# Altium schematic sheet AirPurity.SchDoc: [FILL-HERE]
size A3; ApprovedBy: [FILL-HERE]; Author: [FILL-HERE]; Organization: [FILL-HERE]; Address1: [FILL-HERE]; Address2: [FILL-HERE]; Address3: [FILL-HERE]; Address4: [FILL-HERE]; SheetNumber: 1; SheetTotal: 1
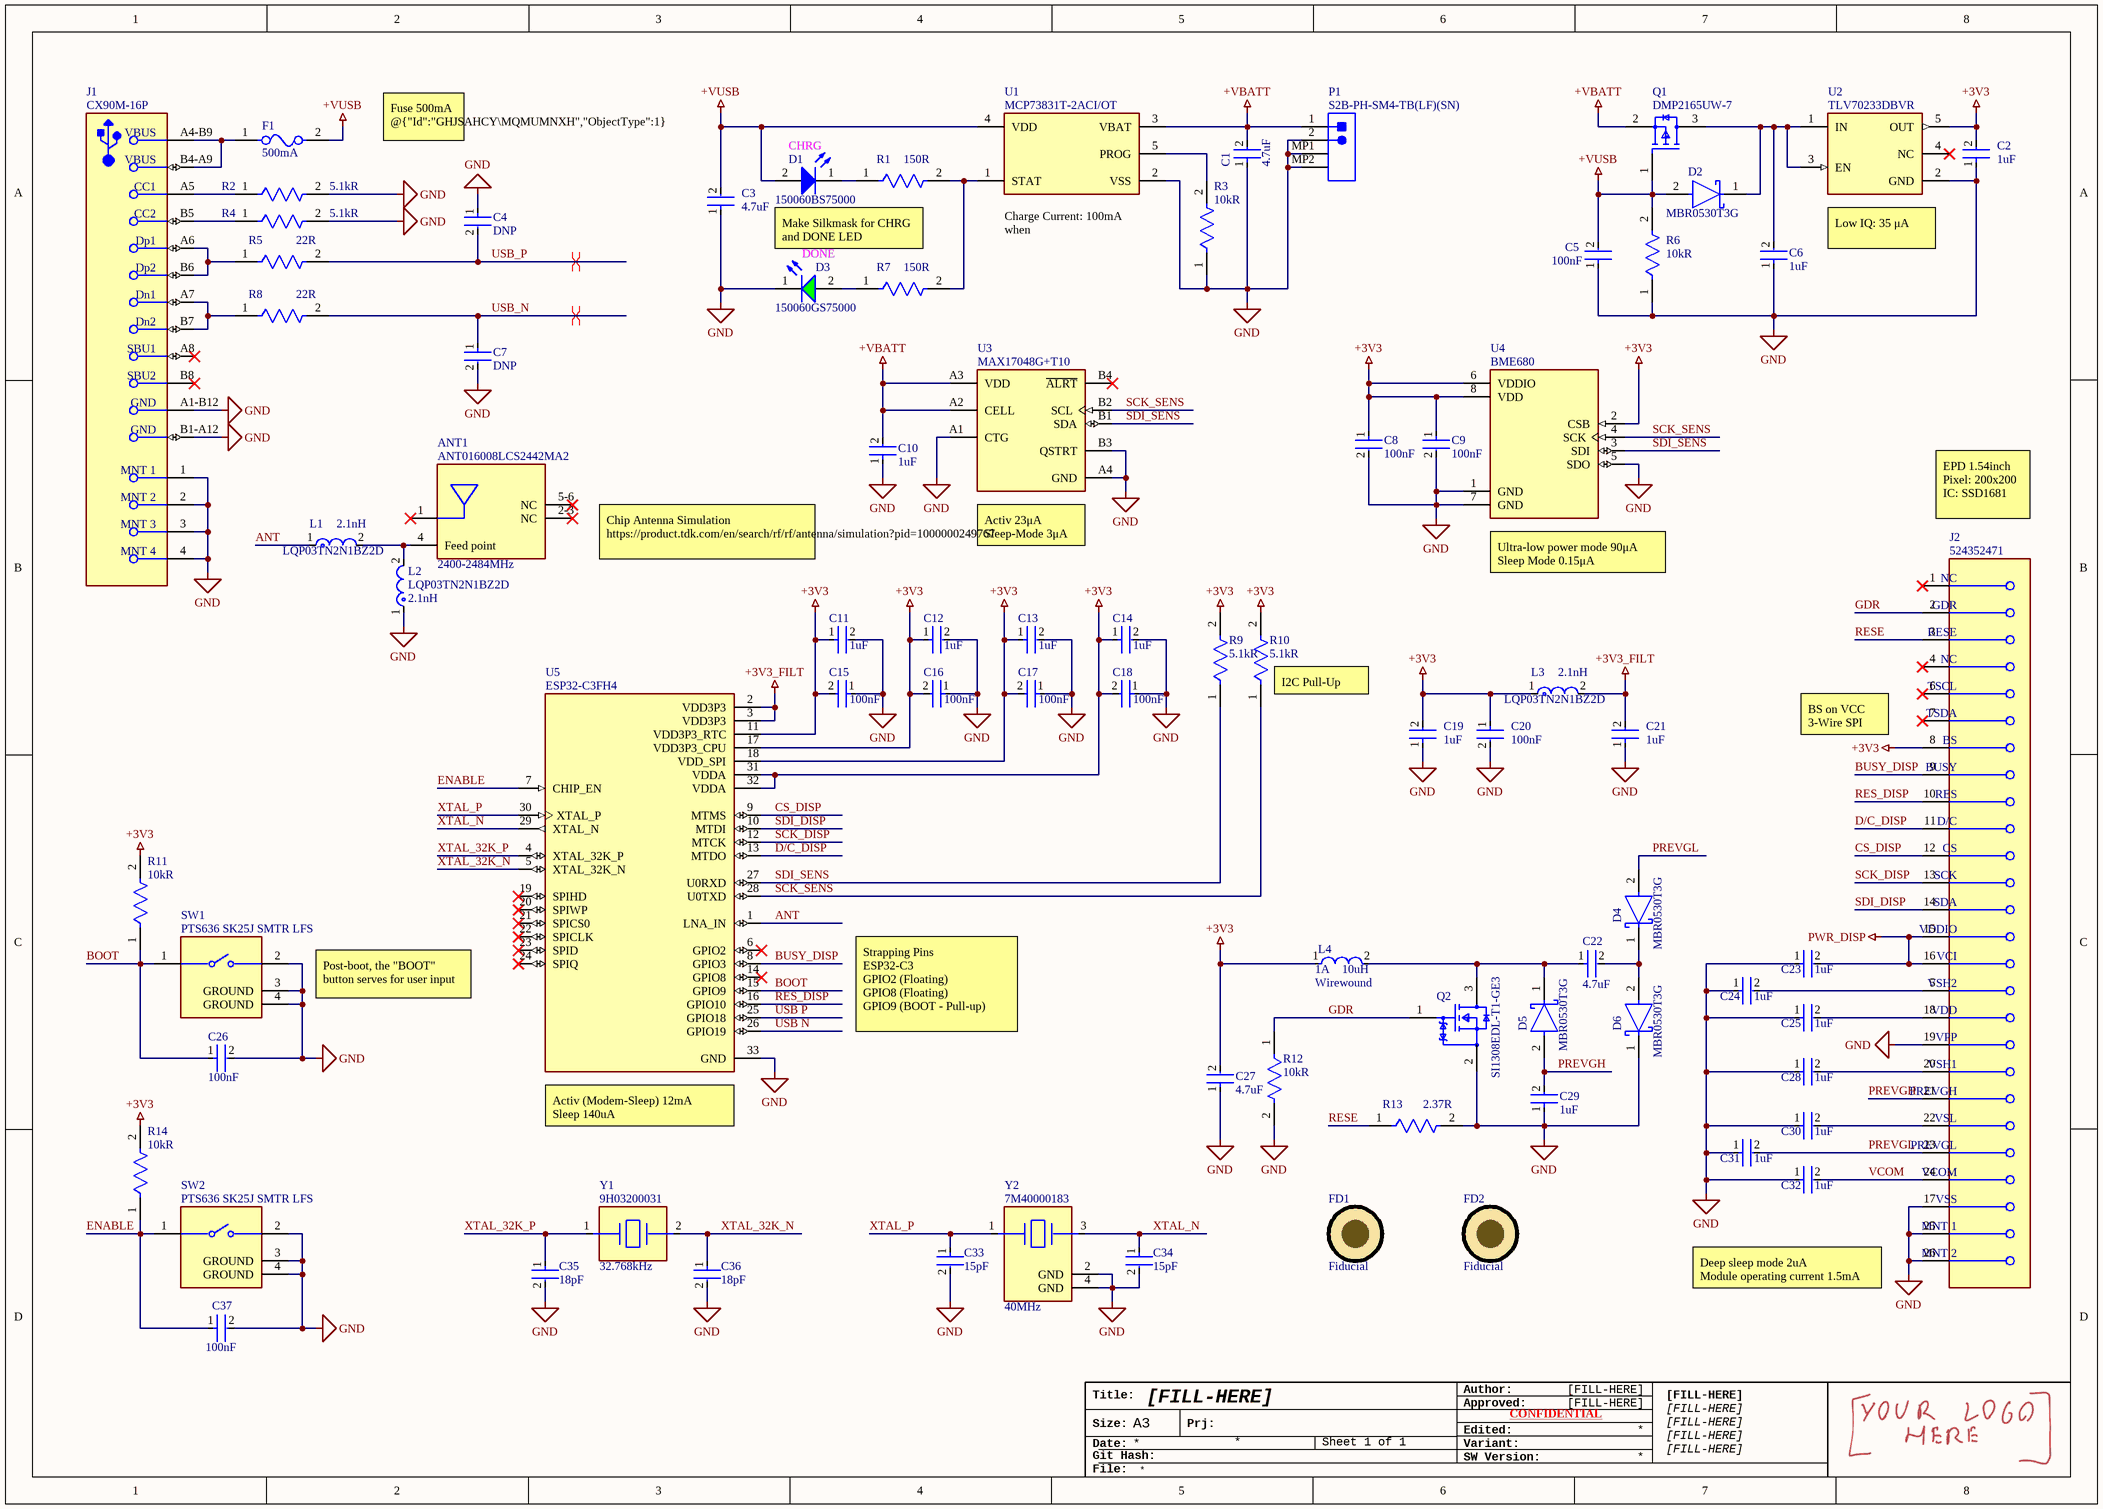
[diagram p0: AirPurity.SchDoc]

## Parts
ANT1  ANT016008LCS2442MA2  Bandwidth: 2400-2484MHz  [FP-ANT016008LCS2442MA2-0]
C1  Capacitance: 4.7uF  [FP-GRM155-0_2-MFG]  (hidden comment: GRM155R61E475ME15D)
C2  Capacitance: 1uF  [FP-GRM155-0_1-MFG]  (hidden comment: GRM155R61E105KA12D)
C3  Capacitance: 4.7uF  [FP-GRM155-0_2-MFG]  (hidden comment: GRM155R61E475ME15D)
C4  Capacitance: DNP  [FP-GRM033-0_03-MFG]  (hidden comment: GRM033R61A104KE15D)
C5  Capacitance: 100nF  [FP-GRM033-0_03-MFG]  (hidden comment: GRM033R61A104KE15D)
C6  Capacitance: 1uF  [FP-GRM155-0_1-MFG]  (hidden comment: GRM155R61E105KA12D)
C7  Capacitance: DNP  [FP-GRM033-0_03-MFG]  (hidden comment: GRM033R61A104KE15D)
C8  Capacitance: 100nF  [FP-GRM033-0_03-MFG]  (hidden comment: GRM033R61A104KE15D)
C9  Capacitance: 100nF  [FP-GRM033-0_03-MFG]  (hidden comment: GRM033R61A104KE15D)
C10  Capacitance: 1uF  [FP-GRM155-0_1-MFG]  (hidden comment: GRM155R61E105KA12D)
C11  Capacitance: 1uF  [FP-GRM155-0_1-MFG]  (hidden comment: GRM155R61E105KA12D)
C12  Capacitance: 1uF  [FP-GRM155-0_1-MFG]  (hidden comment: GRM155R61E105KA12D)
C13  Capacitance: 1uF  [FP-GRM155-0_1-MFG]  (hidden comment: GRM155R61E105KA12D)
C14  Capacitance: 1uF  [FP-GRM155-0_1-MFG]  (hidden comment: GRM155R61E105KA12D)
C15  Capacitance: 100nF  [FP-GRM033-0_03-MFG]  (hidden comment: GRM033R61A104KE15D)
C16  Capacitance: 100nF  [FP-GRM033-0_03-MFG]  (hidden comment: GRM033R61A104KE15D)
C17  Capacitance: 100nF  [FP-GRM033-0_03-MFG]  (hidden comment: GRM033R61A104KE15D)
C18  Capacitance: 100nF  [FP-GRM033-0_03-MFG]  (hidden comment: GRM033R61A104KE15D)
C19  Capacitance: 1uF  [FP-GRM155-0_1-MFG]  (hidden comment: GRM155R61E105KA12D)
C20  Capacitance: 100nF  [FP-GRM033-0_03-MFG]  (hidden comment: GRM033R61A104KE15D)
C21  Capacitance: 1uF  [FP-GRM155-0_1-MFG]  (hidden comment: GRM155R61E105KA12D)
C22  Capacitance: 4.7uF  [FP-GRM155-0_2-MFG]  (hidden comment: GRM155R61E475ME15D)
C23  Capacitance: 1uF  [FP-GRM155-0_1-MFG]  (hidden comment: GRM155R61E105KA12D)
C24  Capacitance: 1uF  [FP-GRM155-0_1-MFG]  (hidden comment: GRM155R61E105KA12D)
C25  Capacitance: 1uF  [FP-GRM155-0_1-MFG]  (hidden comment: GRM155R61E105KA12D)
C26  Capacitance: 100nF  [FP-GRM033-0_03-MFG]  (hidden comment: GRM033R61A104KE15D)
C27  Capacitance: 4.7uF  [FP-GRM155-0_2-MFG]  (hidden comment: GRM155R61E475ME15D)
C28  Capacitance: 1uF  [FP-GRM155-0_1-MFG]  (hidden comment: GRM155R61E105KA12D)
C29  Capacitance: 1uF  [FP-GRM155-0_1-MFG]  (hidden comment: GRM155R61E105KA12D)
C30  Capacitance: 1uF  [FP-GRM155-0_1-MFG]  (hidden comment: GRM155R61E105KA12D)
C31  Capacitance: 1uF  [FP-GRM155-0_1-MFG]  (hidden comment: GRM155R61E105KA12D)
C32  Capacitance: 1uF  [FP-GRM155-0_1-MFG]  (hidden comment: GRM155R61E105KA12D)
C33  Capacitance: 15pF  [FP-GRM033-0_03-IPC_B]  (hidden comment: GRM0335C1H150FA01D)
C34  Capacitance: 15pF  [FP-GRM033-0_03-IPC_B]  (hidden comment: GRM0335C1H150FA01D)
C35  Capacitance: 18pF  [FP-GRM033-0_03-MFG]  (hidden comment: GRM0335C1H180FA01D)
C36  Capacitance: 18pF  [FP-GRM033-0_03-MFG]  (hidden comment: GRM0335C1H180FA01D)
C37  Capacitance: 100nF  [FP-GRM033-0_03-MFG]  (hidden comment: GRM033R61A104KE15D)
D1  150060BS75000  [WL-SMCW_0603_150060xx75000]
D2  MBR0530T3G  [FP-425-04-MFG]
D3  150060GS75000  [WL-SMCW_0603_150060xx75000]
D4  MBR0530T3G  [FP-425-04-MFG]
D5  MBR0530T3G  [FP-425-04-MFG]
D6  MBR0530T3G  [FP-425-04-MFG]
F1  Current Rating: 500mA  [FP-0466-MFG]  (hidden comment: 0466.500NRHF)
FD1  Fiducial  [FIDUCIAL-1MM]
FD2  Fiducial  [FIDUCIAL-1MM]
J1  CX90M-16P  [FP-USB4105-GF-A-MFG]
J2  524352471  [FP-505110-2491-MFG]
L1  LQP03TN2N1BZ2D  Inductance: 2.1nH  [FP-LQP03TG_02-IPC_B]
L2  LQP03TN2N1BZ2D  Inductance: 2.1nH  [FP-LQP03TG_02-IPC_B]
L3  LQP03TN2N1BZ2D  Inductance: 2.1nH  [FP-LQP03TG_02-IPC_B]
L4  Current Rating: 1A  Resistor Type: Wirewound  Inductance: 10uH  [FP-DFE252012C-MFG]  (hidden comment: 1239AS-H-100M=P2)
P1  S2B-PH-SM4-TB(LF)(SN)  [JST- S2B-PH-SM4-TB(LF)(SN)-2_V]
Q1  DMP2165UW-7  [FP-SOT323-IPC_B]
Q2  SI1308EDL-T1-GE3  [FP-5549-MFG]
R1  Resistance: 150R  [FP-AC0402-MFG]  (hidden comment: RC0402FR-07150RL)
R2  Resistance: 5.1kR  [FP-AC0402-MFG]  (hidden comment: RC0402FR-075K1L)
R3  Resistance: 10kR  [FP-AC0402-MFG]  (hidden comment: RC0402FR-0710KL)
R4  Resistance: 5.1kR  [FP-AC0402-MFG]  (hidden comment: RC0402FR-075K1L)
R5  Resistance: 22R  [FP-AC0402-IPC_A]  (hidden comment: RC0402FR-0722RL)
R6  Resistance: 10kR  [FP-AC0402-MFG]  (hidden comment: RC0402FR-0710KL)
R7  Resistance: 150R  [FP-AC0402-MFG]  (hidden comment: RC0402FR-07150RL)
R8  Resistance: 22R  [FP-AC0402-IPC_A]  (hidden comment: RC0402FR-0722RL)
R9  Resistance: 5.1kR  [FP-AC0402-MFG]  (hidden comment: RC0402FR-075K1L)
R10  Resistance: 5.1kR  [FP-AC0402-MFG]  (hidden comment: RC0402FR-075K1L)
R11  Resistance: 10kR  [FP-AC0402-MFG]  (hidden comment: RC0402FR-0710KL)
R12  Resistance: 10kR  [FP-AC0402-MFG]  (hidden comment: RC0402FR-0710KL)
R13  Resistance: 2.37R  [FP-AC0402-IPC_A]  (hidden comment: RC0402FR-072R37L)
R14  Resistance: 10kR  [FP-AC0402-MFG]  (hidden comment: RC0402FR-0710KL)
SW1  PTS636 SK25J SMTR LFS  [FP-PTS636_SKG25_SMTR_LFS-MFG]
SW2  PTS636 SK25J SMTR LFS  [FP-PTS636_SKG25_SMTR_LFS-MFG]
U1  MCP73831T-2ACI/OT  [FP-SOT23-5LD-PL-1-MFG]
U2  TLV70233DBVR  [FP-DBV0005A-MFG]
U3  MAX17048G+T10  [FP-W80B1-1-MFG]
U4  BME680  [PSON80P300X300X100-8N]
U5  ESP32-C3FH4  [QFN50P500X500X90-33N]
Y1  9H03200031  Frequency: 32.768kHz  [FP-ABS07AIG-MFG]
Y2  7M40000183  Frequency: 40MHz  [FP-ABM11-MFG]

## Nets
+3V3: C2.2 C8.1 C9.1 C11.1 C12.1 C13.1 C14.1 C15.2 C16.2 C17.2 C18.2 C19.2 C20.1 C27.2 J2.8 L3.1 L4.1 R9.2 R10.2 R11.2 R14.2 U2.5(OUT) U4.2(CSB) U4.6(VDDIO) U4.8(VDD) U5.11(VDD3P3_RTC) U5.17(VDD3P3_CPU) U5.18(VDD_SPI) U5.31(VDDA) U5.32(VDDA)
+3V3_FILT: C21.2 L3.2 U5.2(VDD3P3) U5.3(VDD3P3)
+VBATT: C1.2 C10.2 P1.1 Q1.2(S) U1.3(VBAT) U3.A2(CELL) U3.A3(VDD)
+VUSB: C3.2 C5.2 D1.2(A) D2.2(A) F1.2 Q1.1(G) R6.2 U1.4(VDD)
GND: C1.1 C2.1 C3.1 C4.1 C5.1 C6.1 C7.2 C8.2 C9.2 C10.1 C11.2 C12.2 C13.2 C14.2 C15.1 C16.1 C17.1 C18.1 C19.1 C20.2 C21.1 C23.1 C24.1 C25.1 C26.2 C27.1 C28.1 C29.1 C30.1 C31.1 C32.1 C33.2 C34.2 C35.2 C36.2 C37.2 D3.1(K) D6.1(C) J1.1(MNT_1) J1.2(MNT_2) J1.3(MNT_3) J1.4(MNT_4) J1.A1-B12(GND) J1.B1-A12(GND) J2.17 J2.19 J2.25(MNT_1) J2.26(MNT_2) L2.1 P1.2 P1.MP1 P1.MP2 Q2.2(S) R2.2 R3.1 R4.2 R6.1 R12.2 R13.2 SW1.2 SW1.3(GROUND) SW1.4(GROUND) SW2.2 SW2.3(GROUND) SW2.4(GROUND) U1.2(VSS) U2.2(GND) U3.A1(CTG) U3.A4(GND) U3.B3(QSTRT) U4.1(GND) U4.5(SDO) U4.7(GND) U5.33(GND) Y2.2(GND) Y2.4(GND)
PWR_DISP: C23.2 J2.15 J2.16
ANT: L1.1 U5.1(LNA_IN)
BOOT: C26.1 R11.1 SW1.1 U5.15(GPIO9)
BUSY_DISP: J2.9 U5.8(GPIO3)
CS_DISP: J2.12 U5.9(MTMS)
D/C_DISP: J2.11 U5.13(MTDO)
ENABLE: C37.1 R14.1 SW2.1 U5.7(CHIP_EN)
GDR: J2.2 Q2.1(G) R12.1
PREVGH: C29.2 D5.2(A) J2.21
PREVGL: C31.2 D4.2(A) J2.23
RES_DISP: J2.10 U5.16(GPIO10)
RESE: J2.3 R13.1
SCK_DISP: J2.13 U5.12(MTCK)
SCK_SENS: R10.1 U3.B2(SCL) U4.4(SCK) U5.28(U0TXD)
SDI_DISP: J2.14 U5.10(MTDI)
SDI_SENS: R9.1 U3.B1(SDA) U4.3(SDI) U5.27(U0RXD)
USB N: U5.26(GPIO19)
USB P: U5.25(GPIO18)
USB_N: C7.1 R8.2
USB_P: C4.2 R5.2
VCOM: C32.2 J2.24
XTAL_32K_N: C36.1 U5.5(XTAL_32K_N) Y1.2
XTAL_32K_P: C35.1 U5.4(XTAL_32K_P) Y1.1
XTAL_N: C34.1 U5.29(XTAL_N) Y2.3
XTAL_P: C33.1 U5.30(XTAL_P) Y2.1
NetANT1_4: ANT1.4(Feed_point) L1.2 L2.2
NetC6_2: C6.2 D2.1(C) Q1.3(D) U2.1(IN) U2.3(EN)
NetC22_1: C22.1 D5.1(C) L4.2 Q2.3(D)
NetC22_2: C22.2 D4.1(C) D6.2(A)
NetC24_2: C24.2 J2.5
NetC25_2: C25.2 J2.18
NetC28_2: C28.2 J2.20
NetC30_2: C30.2 J2.22
NetD1_1: D1.1(K) R1.1
NetD3_2: D3.2(A) R7.1
NetF1_1: F1.1 J1.A4-B9(VBUS) J1.B4-A9(VBUS)
NetJ1_A5: J1.A5(CC1) R2.1
NetJ1_A6: J1.A6(Dp1) J1.B6(Dp2) R5.1
NetJ1_A7: J1.A7(Dn1) J1.B7(Dn2) R8.1
NetJ1_B5: J1.B5(CC2) R4.1
NetR1_2: R1.2 R7.2 U1.1(STAT)
NetR3_2: R3.2 U1.5(PROG)

Not connected (* = marked no-connect by the designer): ANT1 1(Radiator_electrode)* 2-3(NC)* 5-6(NC)*; J1 A8(SBU1)* B8(SBU2)*; J2 1* 4* 6* 7*; U2 4(NC)*; U3 B4(~{ALRT})*; U5 6(GPIO2)* 14(GPIO8)* 19(SPIHD)* 20(SPIWP)* 21(SPICS0)* 22(SPICLK)* 23(SPID)* 24(SPIQ)*

## Layout directives
differential pair: USB_N, USB_P

## Notes on the sheet
- Fuse 500mA @{"Id":"GHJSAHCY\MQMUMNXH","ObjectType":1}
- (near D1) CHRG
- Make Silkmask for CHRG and DONE LED
- (near U1) Charge Current: 100mA
  when @{"Id":"GHJSAHCY\QZYLEHYI"} = 10kR
- (near U2) Low IQ: 35 μA
- (near D3) DONE
- EPD 1.54inch
  Pixel: 200x200
  IC: SSD1681
- Chip Antenna Simulation https://product.tdk.com/en/search/rf/rf/antenna/simulation?pid=1000000249767
- (near U3) Activ 23μA
  Sleep-Mode 3μA
- (near U4) Ultra-low power mode 90μA
  Sleep Mode 0.15μA
- (near R10) I2C Pull-Up
- BS on VCC
  3-Wire SPI
- Post-boot, the "BOOT" button serves for user input
- Strapping Pins
  ESP32-C3
  GPIO2 (Floating)
  GPIO8 (Floating)
  GPIO9 (BOOT - Pull-up)
- (near U5) Activ (Modem-Sleep) 12mA
  Sleep 140uA
- Deep sleep mode 2uA
  Module operating current 1.5mA
- Title:
- Author:
- Approved:
- Size:
- Date:
- Git Hash:
- A3
- Prj:
- SW Version:
- Variant:
- Edited:
- CONFIDENTIAL
- File:
- (in symbol CMP-04775-000015-1) NC; GDR; RESE; TSCL; TSDA; BS; BUSY; RES; D/C; CS; SCK; SDA; VDDIO; VCI; VSH2; VDD; VPP; VSH1; PREVGH; VSL; PREVGL; VCOM; VSS

## Library data of the parts
ANT1 = CMP-08339-000002-1: RF ANT 2.4GHZ CHIP SOLDER SMD; Manufacturer: TDK Corporation; Max Frequency: 2484MHz; Impedance: 50Ω; Number Of Bands: 1; Temperature: -40°C to +85°C; Device Class L1: Integrated Circuits (ICs); Lead Free: Yes; ComponentLink2Description: Datasheet; RoHS: TRUE; Temperature Range High: +85°C; Package: ANT016008LCS2442MA2; Temperature Range Low: -40°C; ComponentLink2URL: https://product.tdk.com/info/en/documents/data_sheet/rf_ant_ant016008lcs2442ma2_summary_en.pdf; Height: 0.4mm; Octopart: https://octopart.com/ant016008lcs2442ma2-tdk-48293801; Device Class L3: RF Antennas; Device Class L2: RF Semiconductors and Devices; Digikey Description: RF ANT 2.4GHZ CHIP SOLDER SMD; Category: Ant; Automotive: No; Manufacturer Part Number: ANT016008LCS2442MA2
C1 C3 C22 C27 = CMP-06035-063317-1: Chip Multilayer Ceramic Capacitors for General Purpose 0402 Package 0.7mm 4.7uF @ 20% 25Vdc X5S @ 22%
C2 C6 C10-C14 C19 C21 C23-C25 C28-C32 = CMP-06035-026840-2: CERAMIC CAP, MLCC 1UF 50VDC X5R
C4 C5 C7-C9 C15-C18 C20 C26 C37 = CMP-2010-01264-2: Chip Multilayer Ceramic Capacitors for General Purpose, 0201, 0.10uF, X5R, 15%, 10%, 10V; Mount: Surface Mount; Dielectric: X5R; Width: 0.012inch; Tolerance: 10%; Radiation Hardening: No; Voltage Rating: 10V; REACH SVHC: No SVHC; Height: 0.3mm; Max Operating Temperature: 85°C; Voltage Rating (DC): 10V; Thickness: 0.013inch; Termination: SMD/SMT; Lead Free: Lead Free; Package Quantity: 1; Case/Package: 0201; Min Operating Temperature: -55°C; Weight: 6E-06oz; Length: 0.6mm; Case Code (Imperial): 0201; Depth: 0.3mm; Voltage: 10V; Packaging: Tape and Reel; Case Code (Metric): 0603
C33 C34 = CMP-06035-001503-1: Chip Multilayer Ceramic Capacitors for General Purpose, 0201, 15pF, C0G, 30ppm/°C, 1%, 50V
C35 C36 = CMP-06035-028008-1: Chip Multilayer Ceramic Capacitors for General Purpose, 0201, 18pF, C0G, 30ppm/°C, 1%, 50V
D1 = CMP-1426-00003-3: NexarPartId: 29717775; Luminous Intensity: 145mcd; Test Current: 20mA; Max Junction Temperature (Tj): 95°C; Max Reverse Voltage (DC): 5V; Dominant Wavelength: 470nm; Power Dissipation: 105mW; Peak Wavelength: 465nm; Forward Voltage: 3.2V; Viewing Angle: 140°; Color: Blue; Forward Current: 100mA; Lens Style: Clear, Rectangular; Mount: Surface Mount; Packaging: Tape and Reel; Min Operating Temperature: -40°C; Length: 1.6mm; Max Operating Temperature: 85°C; Width: 800µm; REACH SVHC: Unknown; Height: 700µm; Case Code (Imperial): 0603; RoHS: Compliant; Case/Package: 0603; Case Code (Metric): 1608; Wavelength: 470nm; Reverse Voltage: 5V
D2 D4-D6 = CMP-2000-05113-2: DIODE SCHOTTKY 30V 500MA SOD123; Polarity: Standard; Max Reverse Leakage Current: 130uA; Forward Voltage: 430mV; Element Configuration: Single; Peak Non-Repetitive Surge Current: 5.5A; REACH SVHC: No SVHC; Contact Plating: Tin; Width: 1.6mm; Weight: 0.03g; Max Reverse Voltage (DC): 30V; Mount: Surface Mount; Max Repetitive Reverse Voltage (Vrrm): 30V; Number of Pins: 2; Height: 1.03mm; Current Rating: 500mA; Max Forward Surge Current (Ifsm): 5.5A; Lead Free: Lead Free; Max Surge Current: 5.5A; Peak Reverse Current: 130uA; Min Operating Temperature: -65°C; Radiation Hardening: No; Max Operating Temperature: 150°C; Average Rectified Current: 500mA; Packaging: Tape and Reel; Length: 2.7mm; Forward Current: 500mA; Voltage Rating (DC): 30V; Package Quantity: 1; Output Current: 500mA
D3 = CMP-1426-00002-3: NexarPartId: 29687084; Color: Green; Power Dissipation: 105mW; Peak Wavelength: 515nm; Viewing Angle: 140°; Test Current: 20mA; Wavelength: 520nm; Lens Style: Clear, Rectangular; Max Junction Temperature (Tj): 95°C; Luminous Intensity: 430mcd; Output Current: 10µA; Max Reverse Voltage (DC): 5V; Forward Voltage: 3.2V; Dominant Wavelength: 525nm; Forward Current: 100mA; Mount: Surface Mount; Height: 700µm; Lead Free: Lead Free; Min Operating Temperature: -40°C; Max Operating Temperature: 85°C; Length: 1.6mm; Width: 800µm; Case/Package: 0603; Case Code (Imperial): 0603; Case Code (Metric): 1608; Packaging: Tape and Reel; Reverse Voltage: 5V; REACH SVHC: Unknown; RoHS: Compliant
F1 = CMP-08605-000090-1: FUSE BOARD MOUNT 500MA 63VAC/VDC; Power Dissipation: 79.2mW; Voltage Rating (DC): 63V; Approvals: UL; Fuse Type: Board Mount (Cartridge Style Excluded); DC Cold Resistance: 248mR; Resistance: 220mR; Series: SlimLine™ 466; Width: 0.06inch; Case Code (Metric): 3216; Housing Material: Ceramic; Current: 500mA; Package Quantity: 5000; Height: 0.023inch; Length: 3.18mm; Case Code (Imperial): 1206; RoHS Compliant: Yes; Voltage Rating (AC): 63V; Min Operating Temperature: -55°C; Max Operating Temperature: 90°C; Depth: 1.52mm; Packaging: Tape and Reel; Case/Package: 1206; Mount: Surface Mount
J1 = CMP-245163-000001-1: CONN RCPT USB2.0 TYPEC 5A; Manufacturer Part Number: USB4105-GF-A; Manufacturer: GCT; Voltage Rating: 20V; Is Female: yes; Current Rating: 5/6.25/1.25/0.25A; Number Of Contacts: 16; Conn Orientation: Right Angle; Device Class L1: Connectors; Category: Conn; Lead Free: Yes; RoHS: TRUE; Temperature Range High: +85°C; Digikey Description: CONN RCPT USB2.0 TYPEC 5A; Device Class L3: unset; ComponentLink2Description: Datasheet; Package: 0; Usb Standard: USB 2.0; Device Class L2: USB Connectors; Automotive: No; Temperature Range Low: -40°C; Height: 3.46mm; Temperature: -40°C to +85°C; Contact Material: Gold,Nickel; ComponentLink2URL: https://gct.co/files/drawings/usb4105.pdf; Octopart: https://octopart.com/usb4105-gf-a-gct-106627878
J2 = CMP-04775-000015-1: CONN FFC/FPC BOTTOM 24P .5MM R/A; Mating Cycles: 25; Actuator Material: Nylon; Voltage Rating: 50V; Number of Contacts: 24; Gender: Receptacle; Actuator Color: Black; Current Rating: 500mA; Pitch: 0.5mm; Orientation: Right Angle; Contact Material: Bronze; Height: 1.9mm; Halogen Free: Low Halogen; Housing Color: Beige; Mount: Surface Mount; Packaging: Cut Tape; Contact Plating: Gold; Termination: Solder; Number of Pins: 24; Number of Rows: 1; Series: Easy-On FD19 505110; Housing Material: Polymer; Number of Positions: 24; Max Operating Temperature: 105°C; Number of Circuits: 24; Min Operating Temperature: -40°C; Flammability Rating: UL94 V-0
L1-L3 = CMP-06042-011982-1: Film type RF Inductor for Automotive 2.1nH ±0.1nH 600mA 0.15Ω 0201 (0603)
  L3: Current Rating: 600mA
L4 = CMP-06042-012626-1: FIXED IND 10UH 1A 460 MOHM SMD; Shielding: Shielded; Core Material: Ferrite; DC Resistance (DCR): 460mR; Max DC Current: 850mA; Test Frequency: 1MHz; Tolerance: 20%; Mount: Surface Mount; Length: 0.098inch; Packaging: Tape and Reel; Min Operating Temperature: -40°C; Width: 0.079inch; Max Operating Temperature: 85°C; Case Code (Metric): 2520; Depth: 2mm; Height - Seated (Max): 0.047inch; Case Code (Imperial): 1008; Case/Package: 1008
P1 = CMP-1755-00001-1: Male Header, Pitch 2 mm, 1 x 2 Position, Height 5.5 mm, -25 to 85 degC, RoHS, Tape and Reel; Current Rating: 3 A; ComponentLink1URL: http://www.jst.com/home2.html; Radiation Hardening: No; RoHSCompliant: True; Mount: Through Hole; Contact Material: Bronze; Package Quantity: 100; Width: 2.34 mm; DatasheetVersion: Dec-12; Height: 8.13 mm; Max Operating Temperature: 105degC; ComponentLink2Description: Datasheet; Lead Pitch: 0.1 inch; Contact Finish: Lead; Packaging: Bulk; Colour: Black; Contact Plating: Tin; Min Operating Temperature: -65degC; ComponentLink1Description: Manufacturer URL; PackageReference: S2B-PH-SM4-TB(LF)(SN)-2; PackageDescription: Male Header, Pitch 2 mm, 1 x 2 Position, Height 5.5 mm; ComponentLink2URL: http://www.jst-mfg.com/product/pdf/eng/ePH.pdf; Pins: 40; Length: 101.19 mm
Q1 = CMP-12801-000112-1: MOSFET BVDSS: 8V-24V SOT323 T&R; Gate to Source Voltage (Vgs): 1V; Rise Time: 8.7ns; Continuous Drain Current (ID): -2.5A; Max Power Dissipation: 700mW; Turn-On Delay Time: 3.7ns; Element Configuration: Single; Drain to Source Resistance: 90mR; Turn-Off Delay Time: 17.8ns; Fall Time: 8ns; Number of Channels: 1; Drain to Source Voltage (Vdss): 20V; Max Operating Temperature: 150°C; Min Operating Temperature: -55°C; Package Quantity: 3000; Packaging: Cut Tape; Case/Package: SOT-323-3; Weight: 0.000212oz
Q2 = CMP-02550-000099-2: MOSFET N-CH 30V 1.4A SC-70-3; Fall Time: 8ns; Max Power Dissipation: 500mW; Rise Time: 9ns; Rds On Max: 132mR; Power Dissipation: 400mW; Polarity: N-CHANNEL; Number of Elements: 1; Element Configuration: Single; Threshold Voltage: 600mV; Continuous Drain Current (ID): 1.5A; Gate to Source Voltage (Vgs): 12V; Turn-On Delay Time: 2ns; Input Capacitance: 105pF; Package Quantity: 3000; REACH SVHC: No SVHC; Mount: Surface Mount; Packaging: Tape and Reel; On-State Resistance: 132mR; Drain-source On Resistance-Max: 132mR; Lead Free: Lead Free; Drain to Source Breakdown Voltage: 30V; Series: TrenchFET®; Max Operating Temperature: 150°C; Drain to Source Resistance: 132mR; Radiation Hardening: No; Length: 2.2mm; Min Operating Temperature: -55°C; Number of Channels: 1; Drain to Source Voltage (Vdss): 30V; Number of Pins: 3; Turn-Off Delay Time: 8ns; Weight: 0.004395oz; RoHS Compliant: Yes; Width: 1.35mm; Height: 1mm; Case/Package: SOT-323
R1 R7 = CMP-2002-01794-3: RES 150Ω ±1% 0.063W 0402; Power Rating: 62.5mW; Voltage Rating: 50V; Max Power Dissipation: 63mW; Temperature Coefficient: 100ppm/°C; Case Code (Metric): 1005; Lead Free: Lead Free; Case Code (Imperial): 0402; Min Operating Temperature: -55°C; RoHS Compliant: Yes; Packaging: Tape and Reel; Case/Package: 0402; Size Code: 0402; Length: 0.039inch; Max Operating Temperature: 155°C; Height: 0.015inch; Termination: SMD/SMT; Series: AC; Width: 0.5mm; Number of Terminations: 2; Tolerance: 1%; Features: Moisture Resistant; Resistor Type: Thick Film; Weight: 2.3E-05oz
R2 R4 R9 R10 = CMP-2002-01829-3: RES 5.1kΩ ±1% 0.063W 0402; Max Power Dissipation: 63mW; Temperature Coefficient: 100ppm/°C; Military Standard: Not; Number of Terminations: 2; Series: AC; Case/Package: 0402; Width: 0.02inch; Power Rating: 63mW; Features: Moisture Resistant; Max Operating Temperature: 155°C; Size Code: 0402; Packaging: Cut Tape; Length: 0.039inch; Lead Free: Lead Free; Mount: Surface Mount; Case Code (Imperial): 0402; Height: 0.015inch; Case Code (Metric): 1005; Depth: 0.5mm; Min Operating Temperature: -55°C; Tolerance: 1%; RoHS Compliant: Yes; Resistor Type: Thick Film
R3 R6 R11 R12 R14 = CMP-2002-01790-3: RES 10kΩ ±1% 0.063W 0402; Power Rating: 62.5mW; Voltage Rating: 50V; Temperature Coefficient: 100ppm/°C; Max Power Dissipation: 63mW; Tolerance: 1%; Military Standard: Not; Construction: Rectangular; Termination: SMD/SMT; Max Operating Temperature: 155°C; Min Operating Temperature: -55°C; Height: 0.015inch; Lead Free: Lead Free; Width: 0.02inch; Case/Package: 0402; Resistor Type: Thick Film; Series: AC; Features: Moisture Resistant; RoHS Compliant: Yes; Number of Terminations: 2; Case Code (Metric): 1005; Length: 0.039inch; Depth: 0.5mm; Size Code: 0402; Packaging: Tape and Reel; Case Code (Imperial): 0402
R5 R8 = CMP-2002-01838-3: RES 0Ω 0.00% 0.063W 0402; Temperature Coefficient: 200ppm/°C; Voltage Rating: 50V; Max Power Dissipation: 63mW; Power Rating: 62.5mW; Tolerance: 5%; Min Operating Temperature: -55°C; RoHS Compliant: Yes; Width: 0.02inch; Height: 0.015inch; Size Code: 0402; Lead Free: Lead Free; Termination: SMD/SMT; Ratings: AEC-Q200; Package Quantity: 1; Number of Terminations: 2; Case Code (Metric): 1005; Case Code (Imperial): 0402; Resistor Type: Thick Film; Features: Moisture Resistant; Length: 0.039inch; Max Operating Temperature: 155°C; Packaging: Tape and Reel; Series: AC; Case/Package: 0402
R13 = CMP-03412-050121-1: RES 3Ω ±1% 0.063W 0402; Max Power Dissipation: 63mW; Temperature Coefficient: 200ppm/°C; Number of Terminations: 2; RoHS Compliant: Yes; Resistor Type: Thick Film; Height: 0.015inch; Length: 0.039inch; Min Operating Temperature: -55°C; Features: Moisture Resistant; Series: AC; Width: 0.02inch; Tolerance: 1%; Packaging: Tape and Reel; Max Operating Temperature: 155°C; Case/Package: 0402
SW1 SW2 = CMP-10040-000025-1: TACT 6.0 X 3.5, 2.5 MM H, 250GF,
U1 = CMP-0133-00143-2: IC CONTROLLR LI-ION 4.2V SOT23-5; Max Power Dissipation: 1.54W; Output Current: 500mA; Max Output Voltage: 4.5V; Number of Outputs: 1; Min Output Voltage: 4.168V; Min Supply Voltage: 3.75V; Max Input Voltage: 6V; Voltage Rating: 4.534V; Drain to Source Resistance: 350mR; Max Operating Temperature: 85°C; Length: 0.122inch; Number of Pins: 5; REACH SVHC: No SVHC; Radiation Hardening: No; Min Operating Temperature: -40°C; Weight: 0.00709oz; Contact Plating: Tin; Termination: SMD/SMT; Case/Package: SOT-23; Mount: Surface Mount; Width: 0.071inch; Packaging: Tape and Reel; Number of Cells: 1; Max Charge Current: 500mA; Height: 0.051inch; Number of Channels: 1; Output Voltage: 4.2V; Max Supply Voltage: 6V; Lead Free: Lead Free
U2 = CMP-0394-00528-4: None; Polarity: Positive; Min Output Voltage: 3.3V; Dropout Voltage: 220mV; Min Current Limit: 320mA; Min Input Voltage: 2V; Output Current: 300mA; Max Power Dissipation: 500mW; Power Supply Rejection Ratio (PSRR): 68dB; Number of Regulators: 1; Accuracy: 2%; Output Type: Fixed; Quiescent Current: 30uA; Max Input Voltage: 5.5V; Output Voltage Accuracy: 0.5%; RoHS Compliant: Yes; REACH SVHC: No SVHC; Radiation Hardening: No; Package Quantity: 1; Case/Package: SOT-23-5; Power Dissipation: 500mW; Max Output Current: 300mA; Max Operating Temperature: 125°C; Nominal Output Voltage: 3.3V; Lead Free: Lead Free; Packaging: Tape and Reel; Max Output Voltage: 3.3V; Number of Outputs: 1; Output Voltage: 3.3V; Number of Pins: 5; Series: -; Min Operating Temperature: -40°C
U3 = CMP-05715-000033-1: IC FUEL GAUGE LI-ION 1CELL 8WLP; Manufacturer: Maxim; Manufacturer Part Number: MAX17048X+T10; Max Supply Voltage: 4.5V; Min Supply Voltage: 2.5V; Number Of Cells: 1; Nominal Supply Current: 23uA; Standoff Height: 0.16mm; Device Class L1: Integrated Circuits (ICs); Package: W80B1-1; Temperature: -40°C to +85°C; Device Class L2: Power Management ICs; Lead Free: Yes; ComponentLink2URL: https://datasheets.maximintegrated.com/en/ds/MAX17048-MAX17049.pdf; Automotive: No; Ipc Land Pattern Name: BGA8N40P4X2_167X93X64; Mouser Description: Fuel Gauge Li-Ion 8-Pin WLP T/R; Temperature Range Low: -40°C; Digikey Description: IC FUEL GAUGE LI-ION 1CELL 8WLP; Device Class L3: Battery Management; Octopart: https://octopart.com/max17048x%2Bt10-maxim+integrated-20327623; Category: IC; Footprint Url: https://pdfserv.maximintegrated.com/en/an/AN1891.pdf; Height: 0.69mm; ComponentLink2Description: Datasheet; RoHS: TRUE; Temperature Range High: +85°C
U4 = BME680: Gas, Humidity, Pressure, Temperature Sensor IÂ²C, SPI Output; MF: Bosch Sensortec; Check_prices: https://www.snapeda.com/parts/BME680/Bosch+Sensortec/view-part/?ref=eda; Value: *; Availability: In Stock; MP: BME680; Price: None; Package: LGA-8 Bosch Tools; SnapEDA_Link: https://www.snapeda.com/parts/BME680/Bosch+Sensortec/view-part/?ref=snap; Purchase-URL: https://pricing.snapeda.com/search/part/BME680/?ref=eda
U5 = ESP32-C3FH4: Bluetooth, WiFi 802.11b/g/n, Bluetooth v5.0 Transceiver Module 2.402GHz ~ 2.48GHz Antenna Not Included Surface Mount; MF: Espressif Systems; Check_prices: https://www.snapeda.com/parts/ESP32-C3FH4/Espressif%20Systems/view-part/5881917/?ref=eda; Availability: In Stock; Value: *; Price: None; Purchase-URL: https://pricing.snapeda.com/search/part/ESP32-C3FH4/?ref=eda; MP: ESP32-C3FH4; Package: VFQFN-32 Espressif Systems; SnapEDA_Link: https://www.snapeda.com/parts/ESP32-C3FH4/Espressif%20Systems/view-part/5881917/?ref=snap
Y1 = CMP-27762-015608-1: Crystal 32.768kHz ±20ppm (Tol) 7pF FUND 70kΩ Automotive 2-Pin Mini-CSMD T/R; ESR (Equivalent Series Resistance): 70kR; Packaging: Tape and Reel; Max Operating Temperature: 85°C; Width: 0.059inch; Case/Package: SMD/SMT; RoHS Compliant: Yes; Frequency Tolerance: 20ppm; Mount: Surface Mount; Length: 0.126inch; Ratings: AEC-Q200; Height: 0.035inch; Load Capacitance: 7pF; Min Operating Temperature: -40°C
Y2 = CMP-27762-013416-1: Crystal 40MHz ±10ppm 10pF SMD-4 2mm x 1.6mm